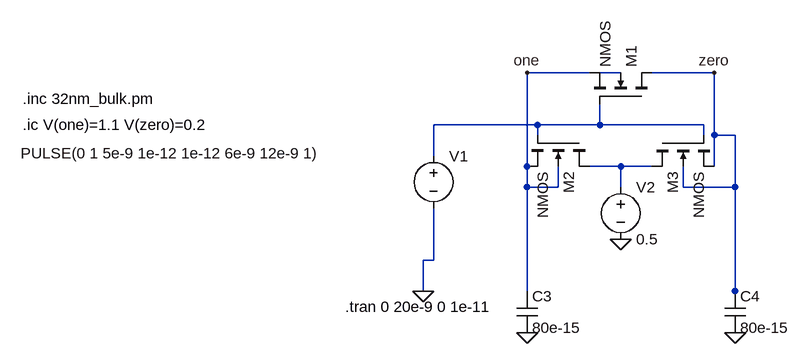
[diagram p0: schematic sense_amplifaer.asc]
sense_amplifaer.asc, the LTspice schematic file:
Version 4
SHEET 1 1096 680
WIRE 128 -224 32 -224
WIRE 176 -224 144 -224
WIRE 320 -224 224 -224
WIRE 48 -144 -112 -144
WIRE 144 -144 144 -176
WIRE 144 -144 48 -144
WIRE 304 -144 144 -144
WIRE 48 -128 48 -144
WIRE 304 -128 304 -144
WIRE 320 -128 320 -224
WIRE 352 -128 320 -128
WIRE -112 -96 -112 -144
WIRE 32 -80 32 -224
WIRE 176 -80 128 -80
WIRE 224 -80 176 -80
WIRE 320 -80 320 -128
WIRE 32 -48 32 -80
WIRE 80 -48 80 -80
WIRE 80 -48 32 -48
WIRE 176 -48 176 -80
WIRE 272 -48 272 -80
WIRE 352 -48 352 -128
WIRE 352 -48 272 -48
WIRE -112 64 -112 -16
WIRE -112 64 -128 64
WIRE -128 112 -128 64
WIRE 32 112 32 -48
WIRE 352 112 352 -48
WIRE 352 128 352 112
FLAG -128 112 0
FLAG 32 -224 one
FLAG 320 -224 zero
FLAG 176 32 0
FLAG 352 176 0
FLAG 32 176 0
SYMBOL voltage -112 -112 R0
WINDOW 3 -635 12 Left 2
WINDOW 123 0 0 Left 0
WINDOW 39 0 0 Left 0
SYMATTR Value PULSE(0 1 5e-9 1e-12 1e-12 6e-9 12e-9 1)
SYMATTR InstName V1
SYMBOL voltage 176 -64 R0
WINDOW 123 0 0 Left 0
WINDOW 39 0 0 Left 0
SYMATTR InstName V2
SYMATTR Value 0.5
SYMBOL cap 16 112 R0
SYMATTR InstName C3
SYMATTR Value 80e-15
SYMBOL cap 336 112 R0
SYMATTR InstName C4
SYMATTR Value 80e-15
SYMBOL nmos4 224 -176 M270
SYMATTR InstName M1
SYMATTR Value2 l=32e-9 w=320e-9 ad=51200e-18 as=51200e-18 pd=960e-9 ps=960e-9
SYMBOL nmos4 128 -128 R90
SYMATTR InstName M2
SYMATTR Value2 l=32e-9 w=320e-9 ad=51200e-18 as=51200e-18 pd=960e-9 ps=960e-9
SYMBOL nmos4 224 -128 M90
SYMATTR InstName M3
SYMATTR Value2 l=32e-9 w=320e-9 ad=51200e-18 as=51200e-18 pd=960e-9 ps=960e-9
TEXT -744 -184 Left 2 !.inc 32nm_bulk.pm
TEXT -248 136 Left 2 !.tran 0 20e-9 0 1e-11
TEXT -744 -144 Left 2 !.ic V(one)=1.1 V(zero)=0.2

The netlist it stands for:
* sense_amplifaer.asc
V1 N002 0 PULSE(0 1 5e-9 1e-12 1e-12 6e-9 12e-9 1)
V2 N003 0 0.5
C3 one 0 80e-15
C4 zero 0 80e-15
M1 zero N002 one N001 NMOS l=32e-9 w=320e-9 ad=51200e-18 as=51200e-18 pd=960e-9 ps=960e-9
M2 N003 N002 one one NMOS l=32e-9 w=320e-9 ad=51200e-18 as=51200e-18 pd=960e-9 ps=960e-9
M3 N003 N002 zero zero NMOS l=32e-9 w=320e-9 ad=51200e-18 as=51200e-18 pd=960e-9 ps=960e-9
.model NMOS NMOS
.model PMOS PMOS
.lib standard.mos
.inc 32nm_bulk.pm
.tran 0 20e-9 0 1e-11
.ic V(one)=1.1 V(zero)=0.2
.backanno
.end